# Altium project vending-pad-002.PrjPcb
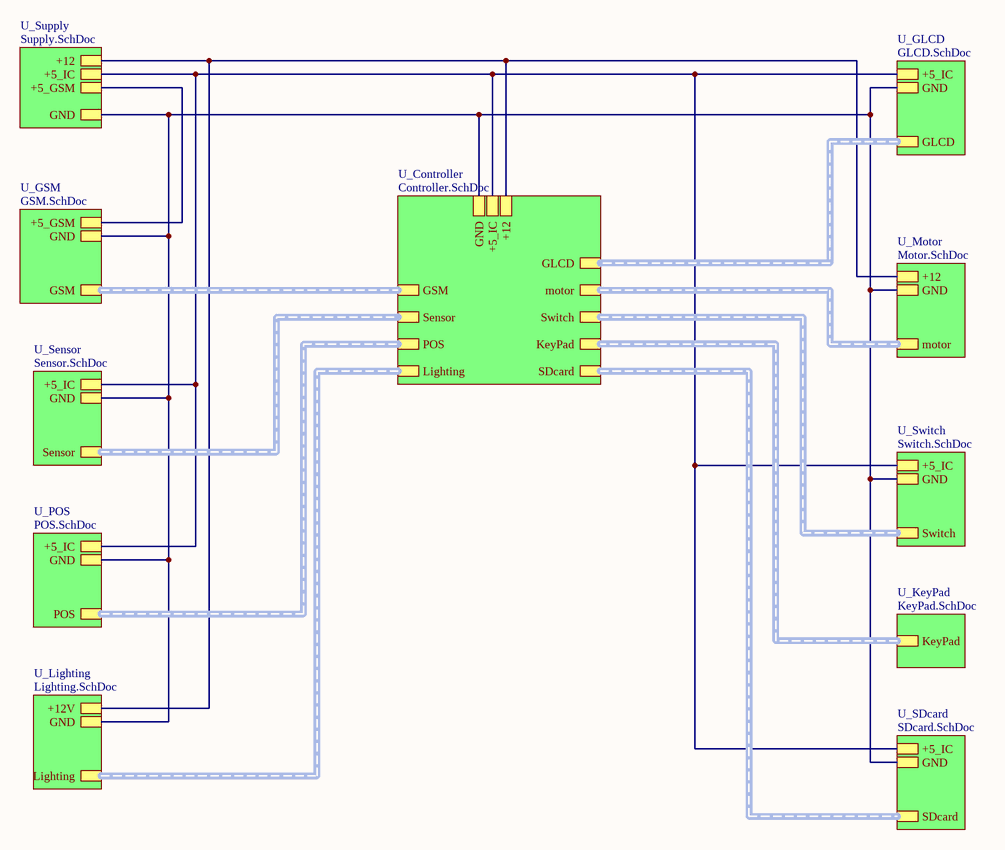
[diagram p0: main.SchDoc]
CompanyName: rshahrami; Project_Name: vend_pad; Revision: 1.0
11 sheets, 105 parts. Net scope: strictly hierarchical (ports join the sheet entries above them; power ports are local).
Board file: PCB.PcbDoc
Sheets:
  main.SchDoc
    U_GLCD = GLCD.SchDoc
    U_Controller = Controller.SchDoc
    U_GSM = GSM.SchDoc
    U_Motor = Motor.SchDoc
    U_POS = POS.SchDoc
    U_Sensor = Sensor.SchDoc
    U_Supply = Supply.SchDoc
    U_Switch = Switch.SchDoc
    U_SDcard = SDcard.SchDoc
    U_Lighting = Lighting.SchDoc

## Sheet main.SchDoc
size A4; SheetNumber: 1; SheetTotal: 12

### Sub-sheets
U_Controller = Controller.SchDoc: GSM (harness GSM), motor (harness motor), Switch (harness Switch), GLCD (harness GLCD), +12, GND, Sensor (harness Sensor), KeyPad (harness KeyPad), SDcard (harness SDcard), Lighting (harness Lighting), POS (harness POS), +5_IC
U_GLCD = GLCD.SchDoc: GLCD (harness GLCD), GND, +5_IC
U_GSM = GSM.SchDoc: GND, GSM (harness GSM), +5_GSM
U_KeyPad = KeyPad.SchDoc (file not in this document): KeyPad (harness KeyPad)
U_Lighting = Lighting.SchDoc: +12V, GND, Lighting (harness Lighting)
U_Motor = Motor.SchDoc: motor (harness motor), +12, GND
U_POS = POS.SchDoc: POS (harness POS), GND, +5_IC
U_SDcard = SDcard.SchDoc: GND, SDcard (harness SDcard), +5_IC
U_Sensor = Sensor.SchDoc: GND, Sensor (harness Sensor), +5_IC
U_Supply = Supply.SchDoc: GND, +12, +5_GSM, +5_IC
U_Switch = Switch.SchDoc: GND, Switch (harness Switch), +5_IC

### Nets
+5_GSM: sheet U_GSM/+5_GSM, sheet U_Supply/+5_GSM
+5_IC: sheet U_GLCD/+5_IC, sheet U_Controller/+5_IC, sheet U_POS/+5_IC, sheet U_Sensor/+5_IC, sheet U_Supply/+5_IC, sheet U_Switch/+5_IC, sheet U_SDcard/+5_IC
+12: sheet U_Controller/+12, sheet U_Motor/+12, sheet U_Supply/+12, sheet U_Lighting/+12V
GND: sheet U_GLCD/GND, sheet U_Controller/GND, sheet U_GSM/GND, sheet U_Motor/GND, sheet U_POS/GND, sheet U_Sensor/GND, sheet U_Supply/GND, sheet U_Switch/GND, sheet U_SDcard/GND, sheet U_Lighting/GND

### Buses and harness runs
harness sheet U_Controller/GLCD = sheet U_GLCD/GLCD
harness sheet U_Controller/GSM = sheet U_GSM/GSM
harness sheet U_Controller/KeyPad = sheet U_KeyPad/KeyPad
harness sheet U_Controller/Lighting = sheet U_Lighting/Lighting
harness sheet U_Controller/motor = sheet U_Motor/motor
harness sheet U_Controller/POS = sheet U_POS/POS
harness sheet U_Controller/SDcard = sheet U_SDcard/SDcard
harness sheet U_Controller/Sensor = sheet U_Sensor/Sensor
harness sheet U_Controller/Switch = sheet U_Switch/Switch

## Sheet GLCD.SchDoc
size A4; SheetNumber: 5; SheetTotal: 12
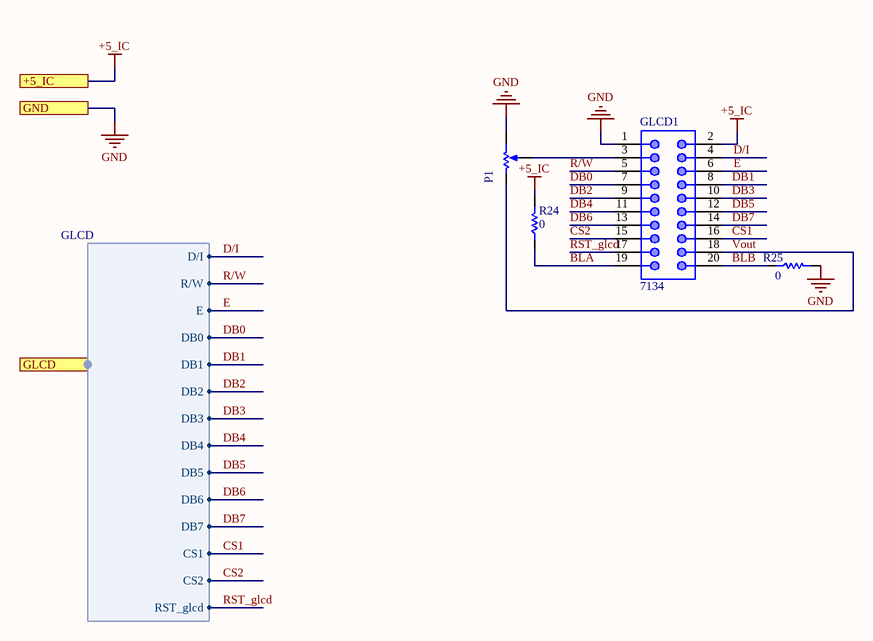
[diagram p1: GLCD.SchDoc]

### Parts
GLCD1  Inflow: 7134  [BOX-HDR-10X2-2.54mm-S]  (hidden comment: 10x2)
P1  10K  [Multi turn 01]  (value not drawn)
R24  0  [RES 1206 (3216X08L)]
R25  0  [RES 1206 (3216X08L)]

### Ports
+5_IC, GLCD (harness GLCD), GND

### Harnesses
GLCD: D/I, R/W, E, DB0, DB1, DB2, DB3, DB4, DB5, DB6, DB7, CS1, CS2, RST_glcd

### Nets
+5_IC: GLCD1.2 R24.2 ; port +5_IC
GND: GLCD1.1 P1.1 R25.2 ; port GND
BLA: GLCD1.19 R24.1
BLB: GLCD1.20 R25.1
CS1: GLCD1.16 ; port GLCD.CS1
CS2: GLCD1.15 ; port GLCD.CS2
D/I: GLCD1.4 ; port GLCD.D/I
DB0: GLCD1.7 ; port GLCD.DB0
DB1: GLCD1.8 ; port GLCD.DB1
DB2: GLCD1.9 ; port GLCD.DB2
DB3: GLCD1.10 ; port GLCD.DB3
DB4: GLCD1.11 ; port GLCD.DB4
DB5: GLCD1.12 ; port GLCD.DB5
DB6: GLCD1.13 ; port GLCD.DB6
DB7: GLCD1.14 ; port GLCD.DB7
E: GLCD1.6 ; port GLCD.E
R/W: GLCD1.5 ; port GLCD.R/W
RST_glcd: GLCD1.17 ; port GLCD.RST_glcd
Vout: GLCD1.18 P1.3
NetGLCD1_3: GLCD1.3 P1.2

### Library data of the parts
GLCD1 = Con_IDC_10x2: Male Box Header, 20 pins; Rating: Rating?; Validation: NT; Value: 10x2; Package: Package?; Type: Type?
P1 = Res_Multi: Multi Turn; Rating: Rating?; Validation: Valid; Inflow: inflow?; Package: Package?; Type: Type?; Value: 10K
R24 R25 = Res_SMD_1206: Resistor; Inflow: inflow?; Rating: 0.25W; Validation: Valid; Package: 1206; Type: 10%; Value: 0

## Sheet Controller.SchDoc
size 254 x 228 mm; SheetNumber: 12; SheetTotal: 12
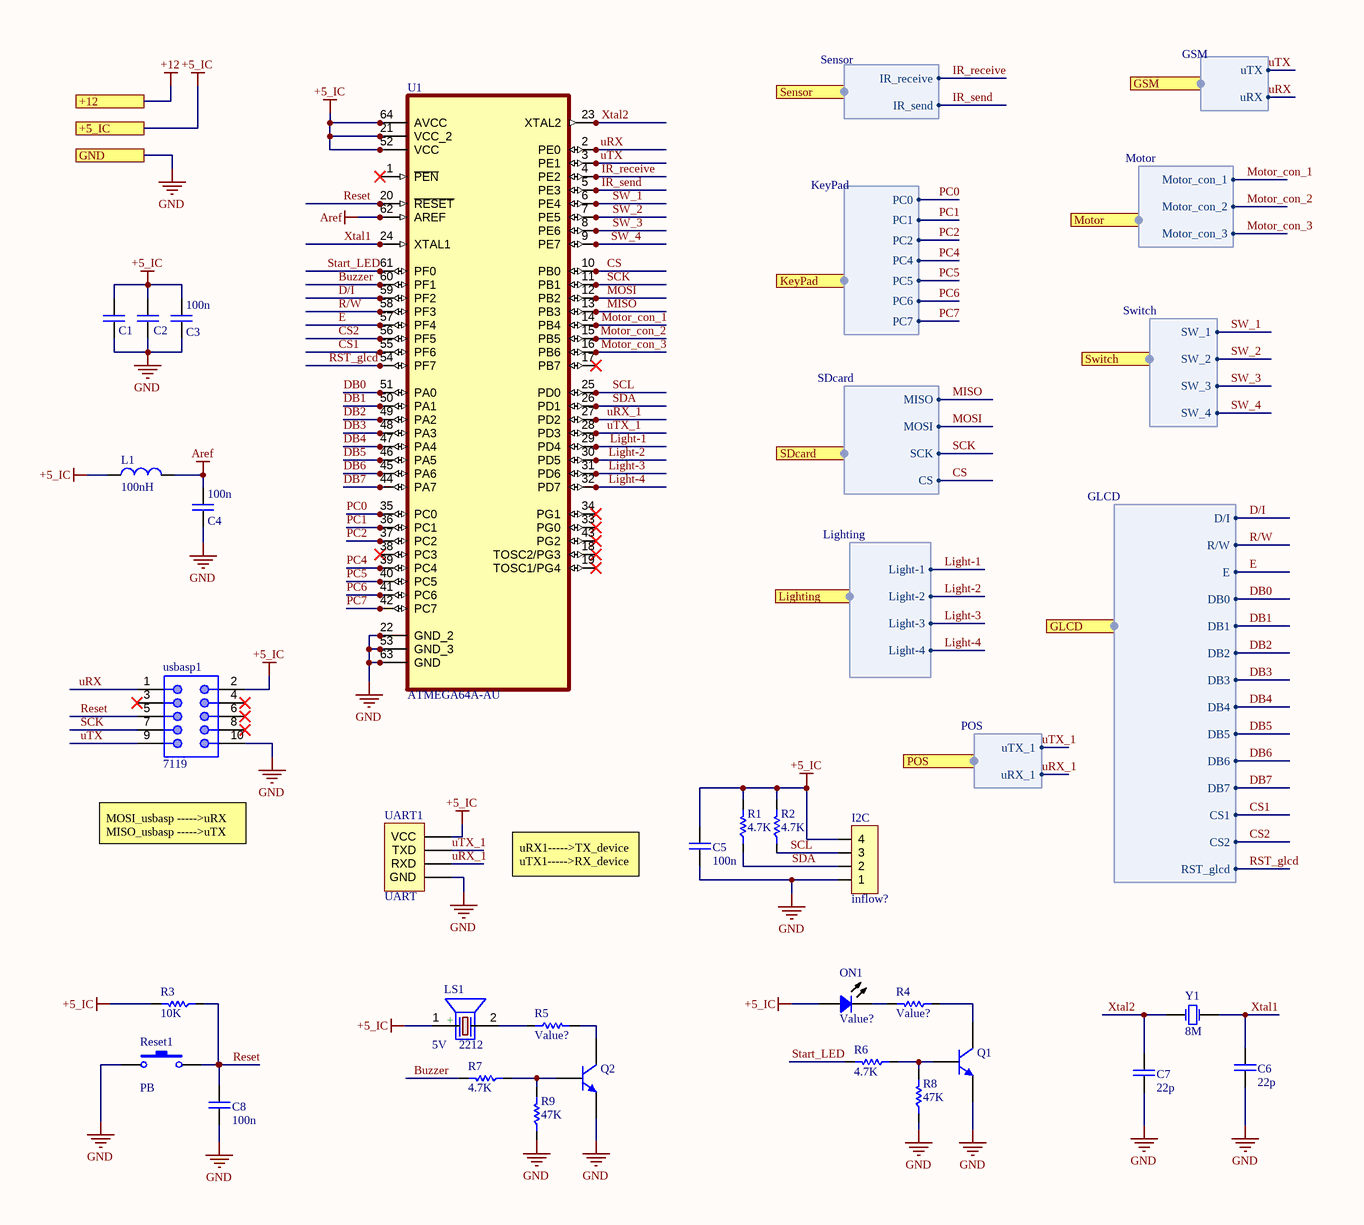
[diagram p2: Controller.SchDoc]

### Parts
C1  (no value)  [CAP 1206/3216]
C2  (no value)  [CAP 1206/3216]
C3  100n  [CAP 1206/3216]
C4  100n  [CAP 1206/3216]
C5  100n  [CAP 1206/3216]
C6  22p  [CAP 1206/3216]
C7  22p  [CAP 1206/3216]
C8  100n  [CAP 1206/3216]
I2C  Inflow: inflow?  [MOLEX KK 0022272041]  (hidden comment: 4'Pin)
L1  100nH  [IND1206]
LS1  Inflow: 2212  [BZ_SJ]  (hidden comment: 5V)
ON1  Value?  [LED 1206/3216 GREEN]
Q1  NPN  [SOT23_N]  (value not drawn)
Q2  NPN  [SOT23_N]  (value not drawn)
R1  value 4.7K  [RES 1206 (3216X08L)]  (hidden comment: Value?)
R2  value 4.7K  [RES 1206 (3216X08L)]  (hidden comment: Value?)
R3  value 10K  [RES 1206 (3216X08L)]  (hidden comment: 4.7K)
R4  value Value?  [RES 1206 (3216X08L)]  (hidden comment: 47K)
R5  Value?  [RES 1206 (3216X08L)]
R6  value 4.7K  [RES 1206 (3216X08L)]  (hidden comment: Value?)
R7  4.7K  [RES 1206 (3216X08L)]
R8  value 47K  [RES 1206 (3216X08L)]  (hidden comment: 4.7K)
R9  47K  [RES 1206 (3216X08L)]
Reset1  PB  [SW_PB_SMD_2PIN_SPST_6X3X2]
U1  ATMEGA64A-AU  [QFP80P1600X1600X120-64N]
UART1  UART  [MOLEX KK 0022272041]
usbasp1  Inflow: 7119  [BOX-HDR-5X2-2.54mm-S]  (hidden comment: 5x2)
Y1  8M  [XTAL Small]

### Ports
+5_IC, +12, GLCD (harness GLCD), GND, GSM (harness GSM), KeyPad (harness KeyPad), Lighting (harness Lighting), Motor (harness Motor), POS (harness POS), SDcard (harness SDcard), Sensor (harness Sensor), Switch (harness Switch)

### Harnesses
GSM: uTX, uRX
Switch: SW_1, SW_2, SW_3, SW_4
GLCD: D/I, R/W, E, DB0, DB1, DB2, DB3, DB4, DB5, DB6, DB7, CS1, CS2, RST_glcd
Sensor: IR_receive, IR_send
KeyPad: PC0, PC1, PC2, PC4, PC5, PC6, PC7
SDcard: MISO, MOSI, SCK, CS
Lighting: Light-1, Light-2, Light-3, Light-4
Motor: Motor_con_1, Motor_con_2, Motor_con_3
POS: uTX_1, uRX_1

### Nets
+5_IC: C1.1 C2.1 C3.1 C5.1 I2C.4 L1.1 LS1.1(+) ON1.1 R1.2 R2.2 R3.2 U1.21(VCC_2) U1.52(VCC) U1.64(AVCC) UART1.1(VCC) usbasp1.2 ; port +5_IC
Aref: C4.1 L1.2 U1.62(AREF)
GND: C1.2 C2.2 C3.2 C4.2 C5.2 C6.2 C7.2 C8.2 I2C.1 Q1.2(E) Q2.2(E) R8.1 R9.1 Reset1.1 U1.22(GND_2) U1.53(GND_3) U1.63(GND) UART1.4(GND) usbasp1.10 ; port GND
IR_receive: U1.4(PE2) ; port Sensor.IR_receive
IR_send: U1.5(PE3) ; port Sensor.IR_send
Buzzer: R7.2 U1.60(PF1)
CS: U1.10(PB0) ; port SDcard.CS
CS1: U1.55(PF6) ; port GLCD.CS1
CS2: U1.56(PF5) ; port GLCD.CS2
D/I: U1.59(PF2) ; port GLCD.D/I
DB0: U1.51(PA0) ; port GLCD.DB0
DB1: U1.50(PA1) ; port GLCD.DB1
DB2: U1.49(PA2) ; port GLCD.DB2
DB3: U1.48(PA3) ; port GLCD.DB3
DB4: U1.47(PA4) ; port GLCD.DB4
DB5: U1.46(PA5) ; port GLCD.DB5
DB6: U1.45(PA6) ; port GLCD.DB6
DB7: U1.44(PA7) ; port GLCD.DB7
E: U1.57(PF4) ; port GLCD.E
Light-1: U1.29(PD4) ; port Lighting.Light-1
Light-2: U1.30(PD5) ; port Lighting.Light-2
Light-3: U1.31(PD6) ; port Lighting.Light-3
Light-4: U1.32(PD7) ; port Lighting.Light-4
MISO: U1.13(PB3) ; port SDcard.MISO
MOSI: U1.12(PB2) ; port SDcard.MOSI
Motor_con_1: U1.14(PB4) ; port Motor.Motor_con_1
Motor_con_2: U1.15(PB5) ; port Motor.Motor_con_2
Motor_con_3: U1.16(PB6) ; port Motor.Motor_con_3
PC0: U1.35(PC0) ; port KeyPad.PC0
PC1: U1.36(PC1) ; port KeyPad.PC1
PC2: U1.37(PC2) ; port KeyPad.PC2
PC4: U1.39(PC4) ; port KeyPad.PC4
PC5: U1.40(PC5) ; port KeyPad.PC5
PC6: U1.41(PC6) ; port KeyPad.PC6
PC7: U1.42(PC7) ; port KeyPad.PC7
R/W: U1.58(PF3) ; port GLCD.R/W
Reset: C8.1 R3.1 Reset1.2 U1.20(~{RESET}) usbasp1.5
RST_glcd: U1.54(PF7) ; port GLCD.RST_glcd
SCK: U1.11(PB1) usbasp1.7 ; port SDcard.SCK
SCL: I2C.3 R2.1 U1.25(PD0)
SDA: I2C.2 R1.1 U1.26(PD1)
Start_LED: R6.2 U1.61(PF0)
SW_1: U1.6(PE4) ; port Switch.SW_1
SW_2: U1.7(PE5) ; port Switch.SW_2
SW_3: U1.8(PE6) ; port Switch.SW_3
SW_4: U1.9(PE7) ; port Switch.SW_4
uRX: U1.2(PE0) usbasp1.1 ; port GSM.uRX
uRX_1: U1.27(PD2) UART1.3(RXD) ; port POS.uRX_1
uTX: U1.3(PE1) usbasp1.9 ; port GSM.uTX
uTX_1: U1.28(PD3) UART1.2(TXD) ; port POS.uTX_1
Xtal1: C6.1 U1.24(XTAL1) Y1.2(OSC2)
Xtal2: C7.1 U1.23(XTAL2) Y1.1(OSC1)
NetLS1_2: LS1.2(-) R5.1
NetON1_2: ON1.2 R4.2
NetQ1_1: Q1.1(B) R6.1 R8.2
NetQ1_3: Q1.3(C) R4.1
NetQ2_1: Q2.1(B) R7.1 R9.2
NetQ2_3: Q2.3(C) R5.2

Not connected (* = marked no-connect by the designer): U1 1(~{PEN})* 17(PB7)* 18(TOSC2/PG3)* 19(TOSC1/PG4)* 33(PG0)* 34(PG1)* 38(PC3)* 43(PG2)*; usbasp1 3* 4* 6* 8*

### Notes on the sheet
- MOSI_usbasp ----->uRX MISO_usbasp ----->uTX
- uRX1----->TX_device
  uTX1----->RX_device
- DWG. NO.
- REV.
- SHT.
- THIS DOCUMENT AND THE DATA DISCLOSED HEREIN OR HEREWITH IS THE PROPERTY OF ALTIUM LIMITED AND MAY BE FREELY DISTRIBUTED IN WHOLE. NO RIGHTS ARE RESERVED OR EXPRESS OR IMPLIED WARANTEE GIVEN.
- REVISION
- DESCRIPTION
- DATE
- APPROVED
- ENG:
- APPROVALS
- PROJECT
- DSN:
- CHK:
- REFERENCE DOCUMENTS
- PROJECT REVISION:
- TITLE
- DOCUMENT REVISION:
- DESIGN ITEM:
- BOM:
- FAB DWG:
- PCB DWG:
- ASSY DWG:
- SCALE:
- SIZE
- B
- CAGE CODE
- FILE NAME
- DWG NO.
- SHEET
- OF
- REV

### Library data of the parts
C1-C8 = Cap_Multi_SMD_100nF_1206: Bipolar ceramic capacitor SMD; Type: MultiLayer; Inflow: inflow?; Rating: 50V; Validation: Valid; Package: 1206
  C3-C5 C8: Value: 100n
  C6 C7: Value: 22p
I2C = Con_Signal_4: Signal Connector 4'Pin; Rating: Rating?; Validation: Valid; Value: 4'Pin; Package: Package?; Type: Type?
L1 = Ind_SMD_1206: Inductor; Inflow: inflow?; Type: SMD; Rating: Rating?; Validation: Valid; Package: 1206; Value: 100nH
LS1 = Other_Elec_Buzzer: Magnetic Transducer Buzzer; Rating: 12mm; Validation: Valid; Type: Buzzer; Package: Dip; Value: 5V
ON1 = Semi_LED_SMD: LED; Inflow: inflow?; Rating: Rating?; Validation: Valid; Package: Package?; Type: LED; Value: Value?
Q1 Q2 = Semi_BJT_BC817: NPN General purpose Transistor; Rating: Rating?; Type: Type?; Validation: Valid; Inflow: inflow?; Value: NPN; Package: Package?
R1 R2 = Res_SMD_0805: Resistor; Inflow: inflow?; Rating: 0.125W; Validation: Valid; Package: 0805; Type: 10%
R3-R9 = Res_SMD_1206: as R24 on sheet GLCD; Package: 1206; Type: 10%
  R5: Value: Value?
  R7: Value: 4.7K
  R9: Value: 47K
Reset1 = SW_PushButton_2_SMD: SMT Tactile ‎Switch; Rating: 2b; Validation: Valid; Inflow: 8260; Type: Vertical; Package: SMD; Value: PB
U1 = ATMEGA64A-AU: AVR AVRÂ® ATmega Microcontroller IC 8-Bit 16MHz 64KB (32K x 16) FLASH 64-TQFP (14x14); MF: Microchip; SnapEDA_Link: https://www.snapeda.com/parts/ATMEGA64A-AU/Microchip/view-part/?ref=snap; Package: TQFP-64 Microchip; Value: *; MP: ATMEGA64A-AU; Check_prices: https://www.snapeda.com/parts/ATMEGA64A-AU/Microchip/view-part/?ref=eda
UART1 = Con_UART: UART Connector; Rating: Rating?; Validation: Valid; Inflow: 4528; Package: Package?; Type: Type?; Value: UART
usbasp1 = Con_IDC_5x2: Male Box Header, 10 pins; Rating: Rating?; Validation: NT; Value: 5x2; Package: Package?; Type: Type?
Y1 = Other_Elec_Xtal_THT: Crystal Oscillator; Rating: Rating?; Inflow: inflow?; Validation: Valid; Type: Quartz; Package: Dip; Value: 8M

## Sheet GSM.SchDoc
size A4; SheetNumber: 3; SheetTotal: 12
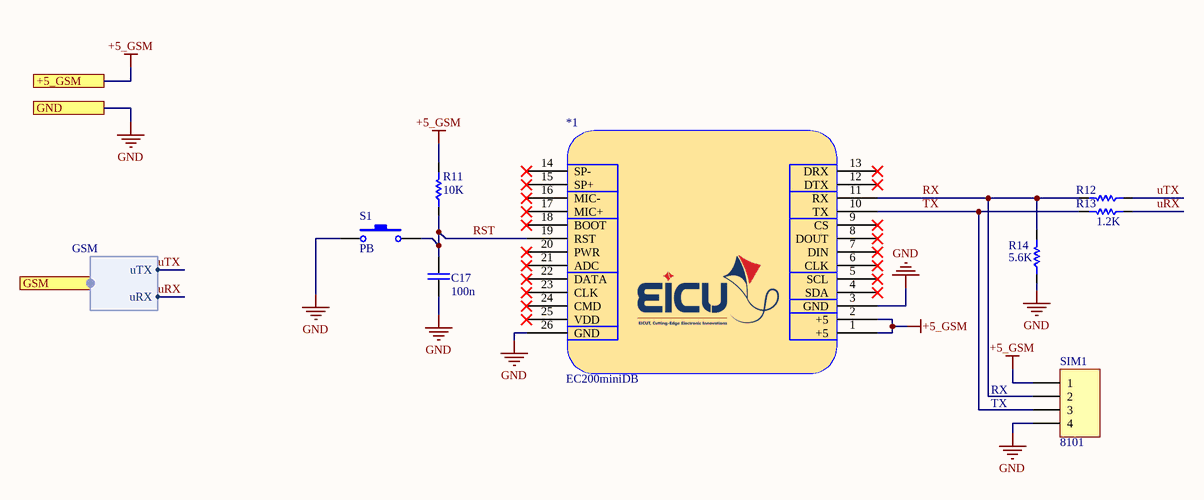
[diagram p3: GSM.SchDoc]

### Parts
*1  EC200miniDB  [PCBComponent_1]
C17  100n  [CAP 1206/3216]
R11  10K  [RES 1206 (3216X08L)]
R12  47K  [RES 1206 (3216X08L)]  (value not drawn)
R13  value 1.2K  [RES 1206 (3216X08L)]  (hidden comment: 1K)
R14  5.6K  [RES 1206 (3216X08L)]
S1  PB  [SW_PB_SMD_2PIN_SPST_6X3X2]
SIM1  Inflow: 8101  [HDR_THT_4F_2.54mm]  (hidden comment: 4)

### Ports
+5_GSM, GND, GSM (harness GSM)

### Harnesses
GSM: uTX, uRX

### Nets
+5_GSM: *1.1(+5) *1.2(+5) R11.2 SIM1.1 ; port +5_GSM
GND: *1.3(GND) *1.26(GND) C17.2 R14.1 S1.2 SIM1.4 ; port GND
RST: *1.19(RST) C17.1 R11.1 S1.1
RX: *1.11(RX) R12.2 R14.2 SIM1.2
TX: *1.10(TX) R13.2 SIM1.3
uRX: R13.1 ; port GSM.uRX
uTX: R12.1 ; port GSM.uTX

Not connected (* = marked no-connect by the designer): *1 4(SDA)* 5(SCL)* 6(CLK)* 7(DIN)* 8(DOUT)* 9(CS)* 12(DTX)* 13(DRX)* 14(SP-)* 15(SP+)* 16(MIC-)* 17(MIC+)* 18(BOOT)* 20(PWR)* 21(ADC)* 22(DATA)* 23(CLK)* 24(CMD)* 25(VDD)*

### Notes on the sheet
- RX
- TX

### Library data of the parts
*1 = EC200miniDB: EICUT.com
C17 = Cap_Multi_SMD_100nF_1206: as C1 on sheet Controller; Package: 1206; Value: 100n
R11-R14 = Res_SMD_1206: as R24 on sheet GLCD; Package: 1206; Type: 10%
  R11: Value: 10K
  R12: Value: 47K
  R14: Value: 5.6K
S1 = SW_PushButton_2_SMD: as Reset1 on sheet Controller; Type: Vertical; Package: SMD; Value: PB
SIM1 = Con_FPH_4x1_V_THT_2.54: Header, single row, 4 pin; Rating: Rating?; Validation: NT; Value: 4; Package: Package?; Type: Type?

## Sheet Motor.SchDoc
size A4; SheetNumber: 4; SheetTotal: 12
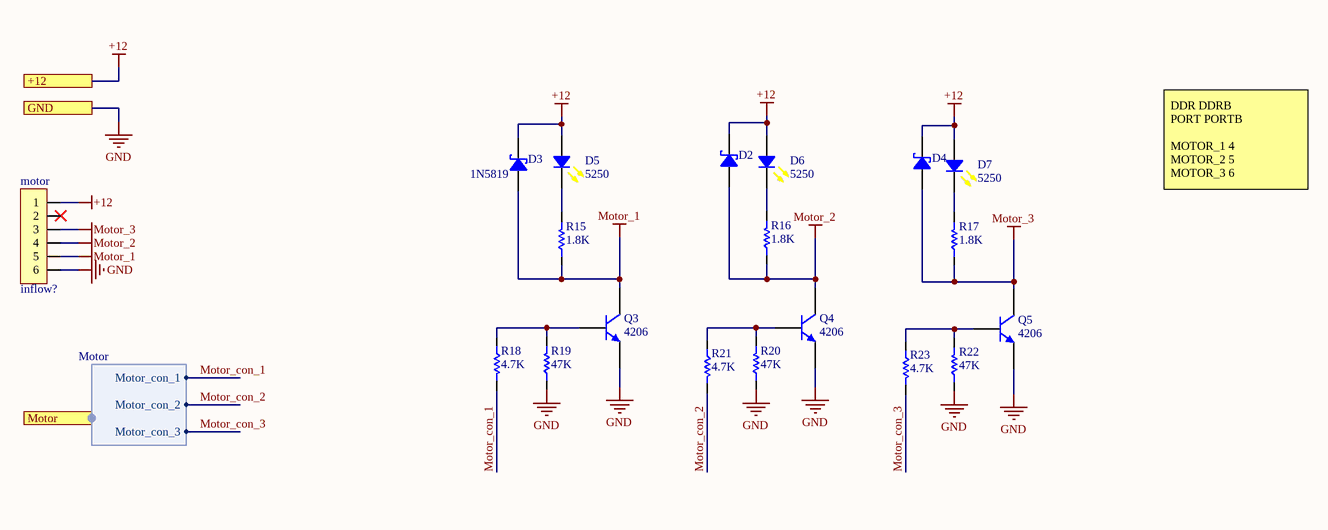
[diagram p4: Motor.SchDoc]

### Parts
D2  1N5819  [430X270D]  (value not drawn)
D3  1N5819  [430X270D]
D4  1N5819  [430X270D]  (value not drawn)
D5  Inflow: 5250  [LED 1206/3216 YELLOW]  (hidden comment: Yellow, 1206)
D6  Inflow: 5250  [LED 1206/3216 YELLOW]  (hidden comment: Yellow, 1206)
D7  Inflow: 5250  [LED 1206/3216 YELLOW]  (hidden comment: Yellow, 1206)
motor  Inflow: inflow?  [MOLEX KK 0022272061]  (hidden comment: 6'Pin)
Q3  Inflow: 4206  [TO-220 AB]  (hidden comment: NPN)
Q4  Inflow: 4206  [TO-220 AB]  (hidden comment: NPN)
Q5  Inflow: 4206  [TO-220 AB]  (hidden comment: NPN)
R15  1.8K  [RES 1206 (3216X08L)]
R16  1.8K  [RES 1206 (3216X08L)]
R17  1.8K  [RES 1206 (3216X08L)]
R18  4.7K  [RES 1206 (3216X08L)]
R19  47K  [RES 1206 (3216X08L)]
R20  47K  [RES 1206 (3216X08L)]
R21  4.7K  [RES 1206 (3216X08L)]
R22  47K  [RES 1206 (3216X08L)]
R23  4.7K  [RES 1206 (3216X08L)]

### Ports
+12, GND, Motor (harness Motor)

### Harnesses
Motor: Motor_con_1, Motor_con_2, Motor_con_3

### Nets
+12: D2.2 D3.2 D4.2 D5.1 D6.1 D7.1 motor.1 ; port +12
GND: motor.6 Q3.3(E) Q4.3(E) Q5.3(E) R19.1 R20.1 R22.1 ; port GND
Motor_1: D3.1 motor.5 Q3.2(C) R15.1
Motor_2: D2.1 motor.4 Q4.2(C) R16.1
Motor_3: D4.1 motor.3 Q5.2(C) R17.1
Motor_con_1: R18.2 ; port Motor.Motor_con_1
Motor_con_2: R21.2 ; port Motor.Motor_con_2
Motor_con_3: R23.2 ; port Motor.Motor_con_3
NetD5_2: D5.2 R15.2
NetD6_2: D6.2 R16.2
NetD7_2: D7.2 R17.2
NetQ3_1: Q3.1(B) R18.1 R19.2
NetQ4_1: Q4.1(B) R20.2 R21.1
NetQ5_1: Q5.1(B) R22.2 R23.1

Not connected (* = marked no-connect by the designer): motor 2*

### Notes on the sheet
- DDR DDRB
  PORT PORTB
  MOTOR_1 4
  MOTOR_2 5
  MOTOR_3 6

### Library data of the parts
D2-D4 = Semi_Diod_Sch_1N5819_SMD: Schottky Rectifiers; Rating: Rating?; Validation: Valid; Inflow: inflow?; Package: SMA; Type: Schottky; Value: 1N5819
D5-D7 = Semi_LED_Yellow_1206: LED; Rating: Rating?; Type: Type?; Validation: Valid; Value: Yellow, 1206; Package: Package?
motor = Con_Signal_6: Signal Connector 6'Pin; Rating: Rating?; Validation: Valid; Value: 6'Pin; Package: Package?; Type: Type?
Q3-Q5 = Semi_BJT_TIP41C: NPN Power transistor; Rating: Rating?; Type: Type?; Validation: NT; Value: NPN; Package: Package?
R15-R23 = Res_SMD_1206: as R24 on sheet GLCD; Package: 1206; Type: 10%
  R15-R17: Value: 1.8K
  R18 R21 R23: Value: 4.7K
  R19 R20 R22: Value: 47K

## Sheet POS.SchDoc
size A4; SheetNumber: 8; SheetTotal: 12
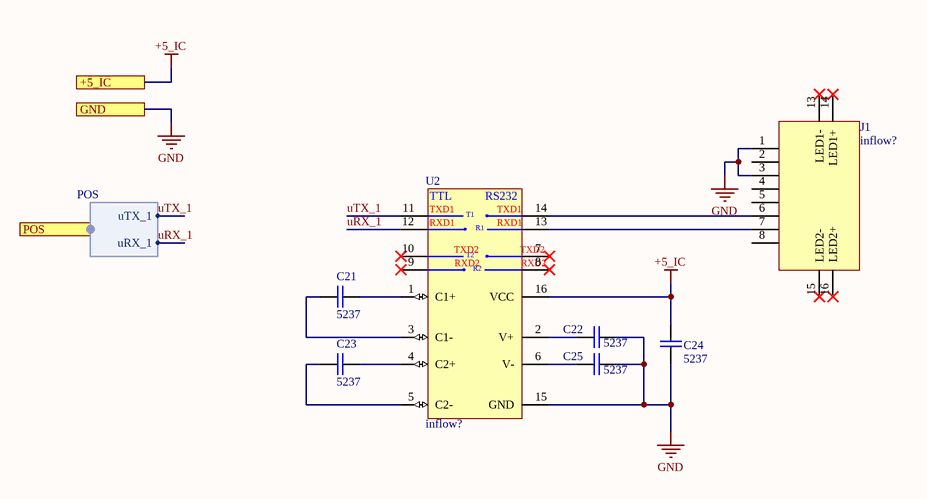
[diagram p5: POS.SchDoc]

### Parts
C21  Inflow: 5237  [CAP 1206/3216]  (hidden comment: 1u'F, 50'V)
C22  Inflow: 5237  [CAP 1206/3216]  (hidden comment: 1u'F, 50'V)
C23  Inflow: 5237  [CAP 1206/3216]  (hidden comment: 1u'F, 50'V)
C24  Inflow: 5237  [CAP 1206/3216]  (hidden comment: 1u'F, 50'V)
C25  Inflow: 5237  [CAP 1206/3216]  (hidden comment: 1u'F, 50'V)
J1  Inflow: inflow?  [RJ45_MINI]  (hidden comment: RJ45, mini)
U2  Inflow: inflow?  [NSO16_M]  (hidden comment: MAX3232)

### Ports
+5_IC, GND, POS (harness POS)

### Harnesses
POS: uTX_1, uRX_1

### Nets
+5_IC: C24.1 U2.16(VCC) ; port +5_IC
GND: C22.2 C24.2 C25.2 J1.1 J1.3 U2.15(GND) ; port GND
uRX_1: U2.12(R1OUT) ; port POS.uRX_1
uTX_1: U2.11(T1IN) ; port POS.uTX_1
NetC21_1: C21.1 U2.1(C1+)
NetC21_2: C21.2 U2.3(C1-)
NetC22_1: C22.1 U2.2(V+)
NetC23_1: C23.1 U2.4(C2+)
NetC23_2: C23.2 U2.5(C2-)
NetC25_1: C25.1 U2.6(V-)
NetJ1_6: J1.6 U2.14(T1OUT)
NetJ1_7: J1.7 U2.13(R1IN)

Not connected (* = marked no-connect by the designer): J1 2 4 5 8 13(LED1-)* 14(LED1+)* 15(LED2-)* 16(LED2+)*; U2 7(T2OUT)* 8(R2IN)* 9(R2OUT)* 10(T2IN)*

### Notes on the sheet
- (in symbol IC_Converter_MAX3232CSE) TTL; TXD1; T1; RXD1; R1; TXD2; T2; RXD2; R2

### Library data of the parts
C21-C25 = Cap_Multi_1u_50_1206: Bipolar ceramic capacitor SMD; Rating: Rating?; Type: Type?; Validation: Valid; Value: 1u'F, 50'V; Package: Package?
J1 = Con_PC_RJ45_MINI: RJ45 Mini With two LEDs; Rating: Rating?; Validation: NT; Value: RJ45, mini; Package: Package?; Type: Type?
U2 = IC_Converter_MAX3232CSE: RS-232 Interface IC 3.0V to 5.5V, Low-Power, up to 1Mbps, True RS-232 Transceivers Using Four 0.1uF External Capacitors; Rating: Rating?; Validation: Valid; Value: MAX3232; Package: SOIC-16; Type: RS232

## Sheet Sensor.SchDoc
size A4; SheetNumber: 6; SheetTotal: 12
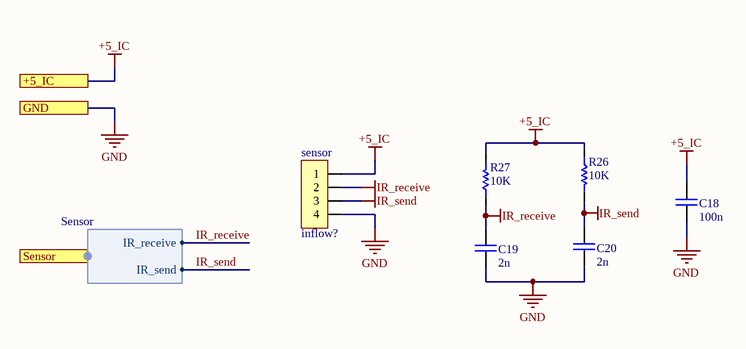
[diagram p6: Sensor.SchDoc]

### Parts
C18  100n  [CAP 1206/3216]
C19  2n  [CAP 1206/3216]
C20  2n  [CAP 1206/3216]
R26  10K  [RES 1206 (3216X08L)]
R27  10K  [RES 1206 (3216X08L)]
sensor  Inflow: inflow?  [MOLEX KK 0022272041]  (hidden comment: 4'Pin)

### Ports
+5_IC, GND, Sensor (harness Sensor)

### Harnesses
Sensor: IR_receive, IR_send

### Nets
+5_IC: C18.1 R26.1 R27.2 sensor.1 ; port +5_IC
GND: C18.2 C19.2 C20.2 sensor.4 ; port GND
IR_receive: C19.1 R27.1 sensor.2 ; port Sensor.IR_receive
IR_send: C20.1 R26.2 sensor.3 ; port Sensor.IR_send

### Library data of the parts
C18-C20 = Cap_Multi_SMD_100nF_1206: as C1 on sheet Controller; Package: 1206
  C18: Value: 100n
  C19 C20: Value: 2n
R26 R27 = Res_SMD_1206: as R24 on sheet GLCD; Package: 1206; Type: 10%; Value: 10K
sensor = Con_Signal_4: as I2C on sheet Controller; Value: 4'Pin; Package: Package?; Type: Type?

## Sheet Supply.SchDoc
size A4; SheetNumber: 2; SheetTotal: 12; Time: Supply
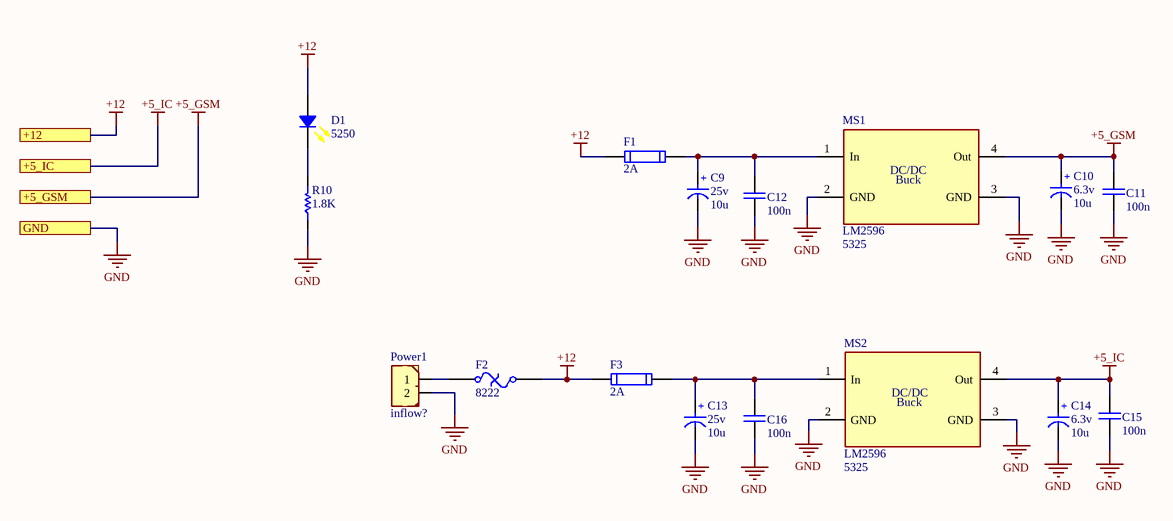
[diagram p7: Supply.SchDoc]

### Parts
C9  Rating: 25v  [SMT_C_Tantalum_B]  (hidden comment: 10u)
C10  Rating: 6.3v  [SMT_C_Tantalum_B]  (hidden comment: 10u)
C11  100n  [CAP 1206/3216]
C12  100n  [CAP 1206/3216]
C13  Rating: 25v  [SMT_C_Tantalum_B]  (hidden comment: 10u)
C14  Rating: 6.3v  [SMT_C_Tantalum_B]  (hidden comment: 10u)
C15  100n  [CAP 1206/3216]
C16  100n  [CAP 1206/3216]
D1  Inflow: 5250  [LED 1206/3216 YELLOW]  (hidden comment: Yellow, 1206)
F1  2A  [1206_F]
F2  Inflow: 8222  [PIN-W2/E2.8]  (hidden comment: 180'C, 10'A)
F3  2A  [1206_F]
MS1  Inflow: 5325  [LM2596_modsen]  (hidden comment: LM2596)
MS2  Inflow: 5325  [LM2596_modsen]  (hidden comment: LM2596)
Power1  Inflow: inflow?  [Phoenix_2PIN_RA_P5.08mm]  (hidden comment: 2'Pin)
R10  1.8K  [RES 1206 (3216X08L)]

### Ports
+5_GSM, +5_IC, +12, GND

### Nets
+5_GSM: C10.1(+) C11.1 MS1.4(Out) ; port +5_GSM
+5_IC: C14.1(+) C15.1 MS2.4(Out) ; port +5_IC
+12: D1.1 F1.1 F2.2 F3.1 ; port +12
GND: C9.2(-) C10.2(-) C11.2 C12.2 C13.2(-) C14.2(-) C15.2 C16.2 MS1.2(GND) MS1.3(GND) MS2.2(GND) MS2.3(GND) Power1.2 R10.1 ; port GND
NetC9_1: C9.1(+) C12.1 F1.2 MS1.1(In)
NetC13_1: C13.1(+) C16.1 F3.2 MS2.1(In)
NetD1_2: D1.2 R10.2
NetF2_1: F2.1 Power1.1

### Notes on the sheet
- Title:
- Project:
- Drawn by:
- Revision:
- Hossein Bagheri
- Company:
- Sheet
- of
- (in symbol ModSen_LM2596) DC/DC; Buck

### Library data of the parts
C9 C10 C13 C14 = Cap_Tantalum: Tantalum Capacitor,TAJ Series-SMD; Inflow: inflow?; Validation: Valid; Package: Package?; Type: Tantalum; Value: 10u
C11 C12 C15 C16 = Cap_Multi_SMD_100nF_1206: as C1 on sheet Controller; Package: 1206; Value: 100n
D1 = Semi_LED_Yellow_1206: as D5 on sheet Motor; Value: Yellow, 1206; Package: Package?
F1 F3 = Other_Elec_Fuse_SMD: Short circiut  protection; Inflow: inflow?; Type: Fast; Rating: Rating?; Validation: Valid; Package: 1206; Value: 2A
F2 = Other_Elec_Fuse_Thermal: Thermal Fuse; Rating: Rating?; Type: Type?; Validation: NT; Value: 180'C, 10'A; Package: Package?
MS1 MS2 = ModSen_LM2596: DC to DC Buck converter 1.23V-30V 3A; Rating: Rating?; Validation: Valid; Package: Package?; Type: Type?; Value: LM2596
Power1 = Con_Power_2: Power Connector 2'Pin; Rating: Rating?; Validation: NT; Value: 2'Pin; Package: Package?; Type: Type?
R10 = Res_SMD_1206: as R24 on sheet GLCD; Package: 1206; Type: 10%; Value: 1.8K

## Sheet Switch.SchDoc
size A; SheetNumber: 7; SheetTotal: 12
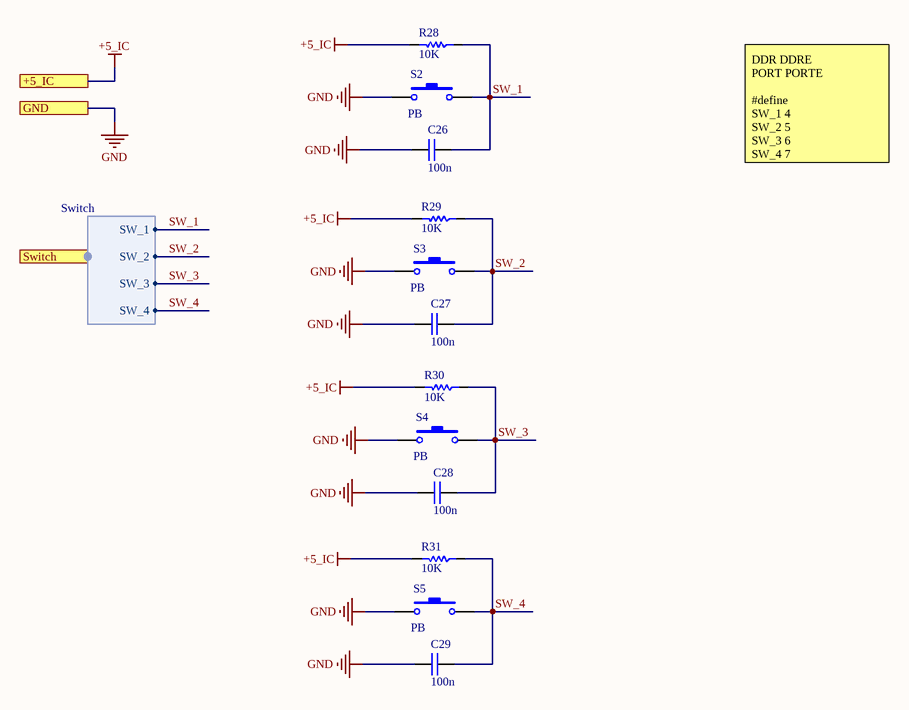
[diagram p8: Switch.SchDoc]

### Parts
C26  100n  [CAP 1206/3216]
C27  100n  [CAP 1206/3216]
C28  100n  [CAP 1206/3216]
C29  100n  [CAP 1206/3216]
R28  10K  [RES 1206 (3216X08L)]
R29  10K  [RES 1206 (3216X08L)]
R30  10K  [RES 1206 (3216X08L)]
R31  10K  [RES 1206 (3216X08L)]
S2  PB  [SW_PB_SMD_2PIN_SPST_6X3X2]
S3  PB  [SW_PB_SMD_2PIN_SPST_6X3X2]
S4  PB  [SW_PB_SMD_2PIN_SPST_6X3X2]
S5  PB  [SW_PB_SMD_2PIN_SPST_6X3X2]

### Ports
+5_IC, GND, Switch (harness Switch)

### Harnesses
Switch: SW_1, SW_2, SW_3, SW_4

### Nets
+5_IC: R28.2 R29.2 R30.2 R31.2 ; port +5_IC
GND: C26.2 C27.2 C28.2 C29.2 S2.1 S3.1 S4.1 S5.1 ; port GND
SW_1: C26.1 R28.1 S2.2 ; port Switch.SW_1
SW_2: C27.1 R29.1 S3.2 ; port Switch.SW_2
SW_3: C28.1 R30.1 S4.2 ; port Switch.SW_3
SW_4: C29.1 R31.1 S5.2 ; port Switch.SW_4

### Notes on the sheet
- DDR DDRE
  PORT PORTE
  #define
  SW_1 4
  SW_2 5
  SW_3 6
  SW_4 7

### Library data of the parts
C26-C29 = Cap_Multi_SMD_100nF_1206: as C1 on sheet Controller; Package: 1206; Value: 100n
R28-R31 = Res_SMD_1206: as R24 on sheet GLCD; Package: 1206; Type: 10%; Value: 10K
S2-S5 = SW_PushButton_2_SMD: as Reset1 on sheet Controller; Type: Vertical; Package: SMD; Value: PB

## Sheet SDcard.SchDoc
size A; SheetNumber: 10; SheetTotal: 12
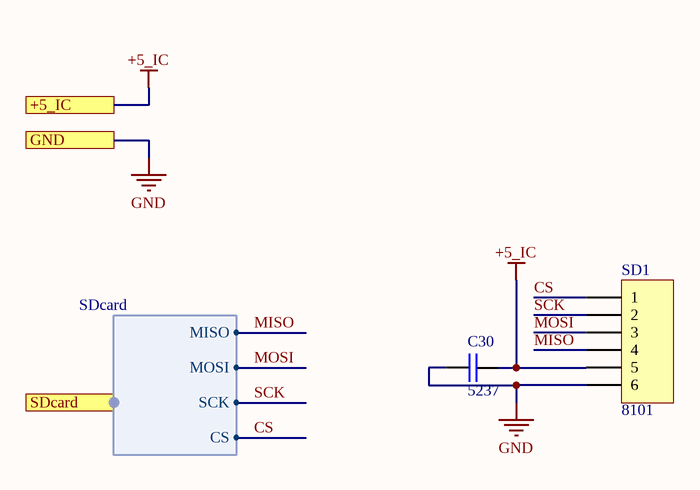
[diagram p9: SDcard.SchDoc]

### Parts
C30  Inflow: 5237  [CAP 1206/3216]  (hidden comment: 1u'F, 50'V)
SD1  Inflow: 8101  [HDR_THT_6F_2.54mm]  (hidden comment: 6)

### Ports
+5_IC, GND, SDcard (harness SDcard)

### Harnesses
SDcard: MISO, MOSI, SCK, CS

### Nets
+5_IC: C30.2 SD1.5 ; port +5_IC
GND: C30.1 SD1.6 ; port GND
CS: SD1.1 ; port SDcard.CS
MISO: SD1.4 ; port SDcard.MISO
MOSI: SD1.3 ; port SDcard.MOSI
SCK: SD1.2 ; port SDcard.SCK

### Library data of the parts
C30 = Cap_Multi_1u_50_1206: as C21 on sheet POS; Value: 1u'F, 50'V; Package: Package?
SD1 = Con_FPH_6x1_V_THT_2.54: Header, single row, 6 pin; Rating: Rating?; Validation: NT; Value: 6; Package: Package?; Type: Type?

## Sheet Lighting.SchDoc
size A; SheetNumber: 11; SheetTotal: 12
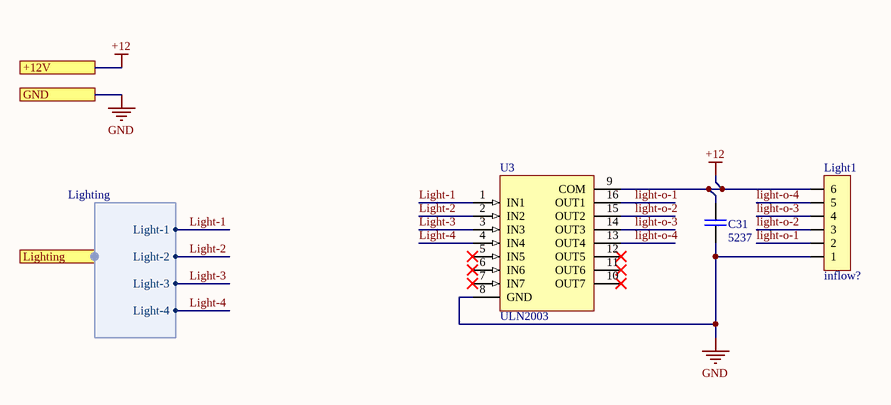
[diagram p10: Lighting.SchDoc]

### Parts
C31  Inflow: 5237  [CAP 1206/3216]  (hidden comment: 1u'F, 50'V)
Light1  Inflow: inflow?  [MOLEX KK 0022272061]  (hidden comment: 6'Pin)
U3  ULN2003  [SO16_M]

### Ports
+12V, GND, Lighting (harness Lighting)

### Harnesses
Lighting: Light-1, Light-2, Light-3, Light-4

### Nets
+12: C31.2 Light1.6 U3.9(COM) ; port +12V
GND: C31.1 Light1.1 U3.8(GND) ; port GND
Light-1: U3.1(IN1) ; port Lighting.Light-1
Light-2: U3.2(IN2) ; port Lighting.Light-2
Light-3: U3.3(IN3) ; port Lighting.Light-3
Light-4: U3.4(IN4) ; port Lighting.Light-4
light-o-1: Light1.2 U3.16(OUT1)
light-o-2: Light1.3 U3.15(OUT2)
light-o-3: Light1.4 U3.14(OUT3)
light-o-4: Light1.5 U3.13(OUT4)

Not connected (* = marked no-connect by the designer): U3 5(IN5)* 6(IN6)* 7(IN7)* 10(OUT7)* 11(OUT6)* 12(OUT5)*

### Library data of the parts
C31 = Cap_Multi_1u_50_1206: as C21 on sheet POS; Value: 1u'F, 50'V; Package: Package?
Light1 = Con_Signal_6: as motor on sheet Motor; Value: 6'Pin; Package: Package?; Type: Type?
U3 = IC_Driver_ULN2003: Seven darlington array drivers; Rating: Rating?; Validation: Valid; Inflow: 1506; Package: SO-16; Type: Driver; Value: ULN2003

## Nets that join several sheets
+5_GSM: GSM (*1.1 *1.2 R11.2 SIM1.1), Supply (C10.1 C11.1 MS1.4)
+5_IC: GLCD (GLCD1.2 R24.2), Controller (16 pins), POS (C24.1 U2.16), Sensor (C18.1 R26.1 R27.2 sensor.1), Supply (C14.1 C15.1 MS2.4), Switch (R28.2 R29.2 R30.2 R31.2), SDcard (C30.2 SD1.5)
+12: Motor (7 pins), Supply (D1.1 F1.1 F2.2 F3.1), Lighting (C31.2 Light1.6 U3.9)
GND: GLCD (GLCD1.1 P1.1 R25.2), Controller (19 pins), GSM (6 pins), Motor (7 pins), POS (6 pins), Sensor (C18.2 C19.2 C20.2 sensor.4), Supply (14 pins), Switch (8 pins), SDcard (C30.1 SD1.6), Lighting (C31.1 Light1.1 U3.8)
IR_receive: Controller (U1.4), Sensor (C19.1 R27.1 sensor.2)
IR_send: Controller (U1.5), Sensor (C20.1 R26.2 sensor.3)
CS: Controller (U1.10), SDcard (SD1.1)
CS1: GLCD (GLCD1.16), Controller (U1.55)
CS2: GLCD (GLCD1.15), Controller (U1.56)
D/I: GLCD (GLCD1.4), Controller (U1.59)
DB0: GLCD (GLCD1.7), Controller (U1.51)
DB1: GLCD (GLCD1.8), Controller (U1.50)
DB2: GLCD (GLCD1.9), Controller (U1.49)
DB3: GLCD (GLCD1.10), Controller (U1.48)
DB4: GLCD (GLCD1.11), Controller (U1.47)
DB5: GLCD (GLCD1.12), Controller (U1.46)
DB6: GLCD (GLCD1.13), Controller (U1.45)
DB7: GLCD (GLCD1.14), Controller (U1.44)
E: GLCD (GLCD1.6), Controller (U1.57)
Light-1: Controller (U1.29), Lighting (U3.1)
Light-2: Controller (U1.30), Lighting (U3.2)
Light-3: Controller (U1.31), Lighting (U3.3)
Light-4: Controller (U1.32), Lighting (U3.4)
MISO: Controller (U1.13), SDcard (SD1.4)
MOSI: Controller (U1.12), SDcard (SD1.3)
Motor_con_1: Controller (U1.14), Motor (R18.2)
Motor_con_2: Controller (U1.15), Motor (R21.2)
Motor_con_3: Controller (U1.16), Motor (R23.2)
R/W: GLCD (GLCD1.5), Controller (U1.58)
RST_glcd: GLCD (GLCD1.17), Controller (U1.54)
SCK: Controller (U1.11 usbasp1.7), SDcard (SD1.2)
SW_1: Controller (U1.6), Switch (C26.1 R28.1 S2.2)
SW_2: Controller (U1.7), Switch (C27.1 R29.1 S3.2)
SW_3: Controller (U1.8), Switch (C28.1 R30.1 S4.2)
SW_4: Controller (U1.9), Switch (C29.1 R31.1 S5.2)
uRX: Controller (U1.2 usbasp1.1), GSM (R13.1)
uRX_1: Controller (U1.27 UART1.3), POS (U2.12)
uTX: Controller (U1.3 usbasp1.9), GSM (R12.1)
uTX_1: Controller (U1.28 UART1.2), POS (U2.11)